# Altium project Squad.PrjPcb (part 1 of 2)
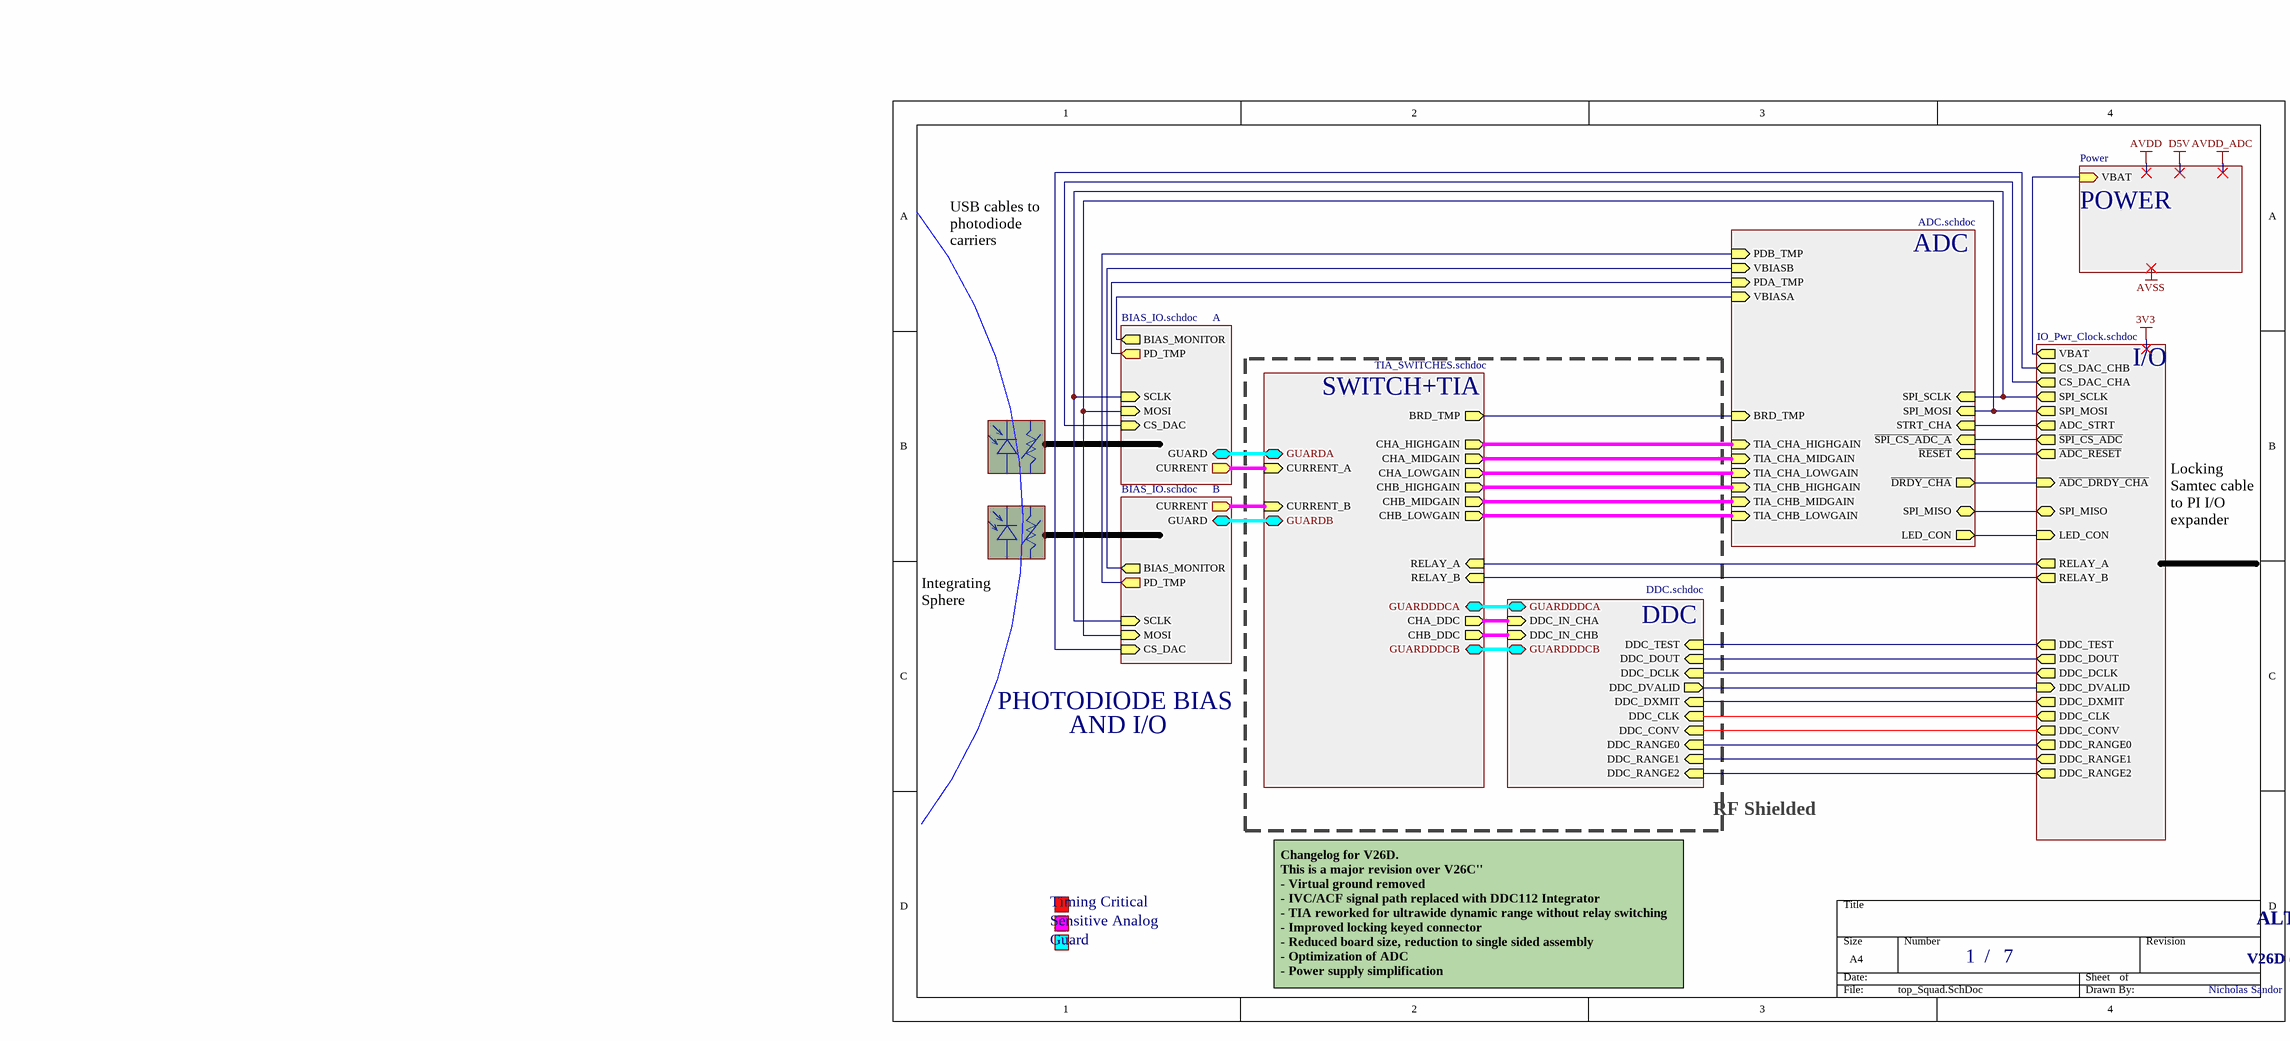
[diagram p0: top_Squad.SchDoc]
DrawnBy: Nicholas Sandor; Revision: V26D (V26.5a)
7 sheets, 171 parts. Net scope: hierarchical (ports join the sheet entries above them; power ports are global).
Board file: ALTAIR_PD_Squad_V26.5a.PcbDoc
Sheets:
  top_Squad.SchDoc
    POWER = Power.SchDoc
    I/O = IO_Pwr_Clock.SchDoc
    ADC = ADC.SchDoc
    SWITCH+TIA = TIA_SWITCHES.SchDoc
    A = BIAS_IO.SchDoc
    B = BIAS_IO.SchDoc
    DDC = DDC.SchDoc

## Sheet top_Squad.SchDoc
size A4; SheetNumber: 1; SheetTotal: 7

### Sub-sheets
A = BIAS_IO.schdoc: CURRENT (out), GUARD (bidir), BIAS_MONITOR (out), PD_TMP (out), SCLK (in), MOSI (in), CS_DAC (in)
ADC = ADC.schdoc: SPI_MISO (bidir), ~{DRDY_CHA} (out), ~{RESET} (in), ~{SPI_CS_ADC_A} (in), STRT_CHA (in), TIA_CHB_LOWGAIN (in), TIA_CHB_MIDGAIN (in), TIA_CHB_HIGHGAIN (in), TIA_CHA_LOWGAIN (in), TIA_CHA_MIDGAIN (in), TIA_CHA_HIGHGAIN (in), BRD_TMP (in), LED_CON (out), VBIASA (in), PDA_TMP (in), SPI_MOSI (in), SPI_SCLK (in), VBIASB (in), PDB_TMP (in)
B = BIAS_IO.schdoc: CURRENT (out), GUARD (bidir), MOSI (in), SCLK (in), CS_DAC (in), BIAS_MONITOR (out), PD_TMP (out)
DDC = DDC.schdoc: DDC_CONV (in), DDC_CLK (in), DDC_IN_CHA (in), DDC_IN_CHB (in), DDC_RANGE2 (in), DDC_RANGE0 (in), DDC_RANGE1 (in), DDC_DXMIT (in), DDC_DVALID (out), DDC_DCLK (in), DDC_DOUT (in), DDC_TEST (in), GUARDDDCA (bidir), GUARDDDCB (bidir)
I/O = IO_Pwr_Clock.schdoc: DDC_RANGE2 (out), DDC_RANGE1 (out), DDC_RANGE0 (out), DDC_CONV (out), DDC_CLK (out), DDC_DXMIT (out), DDC_DVALID (in), DDC_DCLK (out), DDC_DOUT (out), DDC_TEST (out), RELAY_A (out), RELAY_B (out), ~{ADC_DRDY_CHA} (in), ~{SPI_CS_ADC} (out), ~{ADC_RESET} (out), SPI_MISO (bidir), ADC_STRT (out), CS_DAC_CHA (out), VBAT (out), CS_DAC_CHB (out), LED_CON (in), SPI_MOSI (out), SPI_SCLK (out)
POWER = Power: VBAT (in)
SWITCH+TIA = TIA_SWITCHES.schdoc: CHB_HIGHGAIN (out), CHB_MIDGAIN (out), CHB_LOWGAIN (out), CHA_LOWGAIN (out), CHA_MIDGAIN (out), CHA_HIGHGAIN (out), CURRENT_A (in), CURRENT_B (in), CHB_DDC (out), CHA_DDC (out), RELAY_B (in), RELAY_A (in), GUARDDDCA (bidir), GUARDDDCB (bidir), GUARDB (bidir), GUARDA (bidir), BRD_TMP (out)

### Nets
~{DRDY}: sheet I/O/~{ADC_DRDY_CHA}, sheet ADC/~{DRDY_CHA}
~{SPI_CS_ADC}: sheet I/O/~{SPI_CS_ADC}, sheet ADC/~{SPI_CS_ADC_A}
ADC_RESET: sheet I/O/~{ADC_RESET}, sheet ADC/~{RESET}
BRD_TMP_ADCIN: sheet ADC/BRD_TMP, sheet SWITCH+TIA/BRD_TMP
DDC_CLK: sheet I/O/DDC_CLK, sheet DDC/DDC_CLK
DDC_CONV: sheet I/O/DDC_CONV, sheet DDC/DDC_CONV
DDC_DCLK: sheet I/O/DDC_DCLK, sheet DDC/DDC_DCLK
DDC_DOUT: sheet I/O/DDC_DOUT, sheet DDC/DDC_DOUT
DDC_DVALID: sheet I/O/DDC_DVALID, sheet DDC/DDC_DVALID
DDC_DXMIT: sheet I/O/DDC_DXMIT, sheet DDC/DDC_DXMIT
DDC_RANGE0: sheet I/O/DDC_RANGE0, sheet DDC/DDC_RANGE0
DDC_RANGE1: sheet I/O/DDC_RANGE1, sheet DDC/DDC_RANGE1
DDC_RANGE2: sheet I/O/DDC_RANGE2, sheet DDC/DDC_RANGE2
DDC_TEST: sheet I/O/DDC_TEST, sheet DDC/DDC_TEST
GUARD: sheet SWITCH+TIA/GUARDDDCA, sheet SWITCH+TIA/GUARDDDCB, sheet SWITCH+TIA/GUARDB, sheet SWITCH+TIA/GUARDA, sheet A/GUARD, sheet B/GUARD, sheet DDC/GUARDDDCA, sheet DDC/GUARDDDCB
LEDCONTROL_GPIO: sheet I/O/LED_CON, sheet ADC/LED_CON
PD_A: sheet SWITCH+TIA/CURRENT_A, sheet A/CURRENT
PD_A: sheet SWITCH+TIA/CURRENT_B, sheet B/CURRENT  [a separate net that carries the same name]
PD_K: sheet ADC/VBIASA, sheet A/BIAS_MONITOR
PD_K: sheet ADC/VBIASB, sheet B/BIAS_MONITOR  [a separate net that carries the same name]
PDA_TMP_ADCIN: sheet ADC/PDA_TMP, sheet A/PD_TMP
PDB_TMP_ADCIN: sheet ADC/PDB_TMP, sheet B/PD_TMP
RELAY_A: sheet I/O/RELAY_A, sheet SWITCH+TIA/RELAY_A
RELAY_B: sheet I/O/RELAY_B, sheet SWITCH+TIA/RELAY_B
rSPI_MOSI: sheet I/O/SPI_MOSI, sheet ADC/SPI_MOSI, sheet A/MOSI, sheet B/MOSI
rSPI_SCLK: sheet I/O/SPI_SCLK, sheet ADC/SPI_SCLK, sheet A/SCLK, sheet B/SCLK
SPI_CS_DAC_CHA: sheet I/O/CS_DAC_CHA, sheet A/CS_DAC
SPI_CS_DAC_CHB: sheet I/O/CS_DAC_CHB, sheet B/CS_DAC
SPI_MISO: sheet I/O/SPI_MISO, sheet ADC/SPI_MISO
STRT: sheet I/O/ADC_STRT, sheet ADC/STRT_CHA
SYS_VBAT_RB: sheet POWER/VBAT, sheet I/O/VBAT
NetK1_4: sheet SWITCH+TIA/CHB_DDC, sheet DDC/DDC_IN_CHB
NetK1_5: sheet SWITCH+TIA/CHA_DDC, sheet DDC/DDC_IN_CHA
NetR1_2: sheet ADC/TIA_CHA_LOWGAIN, sheet SWITCH+TIA/CHA_LOWGAIN
NetR3_2: sheet ADC/TIA_CHA_MIDGAIN, sheet SWITCH+TIA/CHA_MIDGAIN
NetR8_2: sheet ADC/TIA_CHA_HIGHGAIN, sheet SWITCH+TIA/CHA_HIGHGAIN
NetR14_2: sheet ADC/TIA_CHB_LOWGAIN, sheet SWITCH+TIA/CHB_LOWGAIN
NetR16_2: sheet ADC/TIA_CHB_MIDGAIN, sheet SWITCH+TIA/CHB_MIDGAIN
NetR21_2: sheet ADC/TIA_CHB_HIGHGAIN, sheet SWITCH+TIA/CHB_HIGHGAIN

### Notes on the sheet
- USB cables to photodiode carriers
- Locking Samtec cable to PI I/O expander
- Integrating Sphere
- PHOTODIODE BIAS
- AND I/O
- RF Shielded
- Timing Critical
- Sensitive Analog
- Guard
- Changelog for V26D.
  This is a major revision over V26C''
  - Virtual ground removed
  - IVC/ACF signal path replaced with DDC112 Integrator
  - TIA reworked for ultrawide dynamic range without relay switching
  - Improved locking keyed connector
  - Reduced board size, reduction to single sided assembly
  - Optimization of ADC
  - Power supply simplification
- /
- ALTAIR PhotoDiode ReadOut (PDRO) - Squad
- Labels drawn without touching a wire or pin: AVSS

## Sheet Power.SchDoc
size A4; SheetNumber: 3; SheetTotal: 7
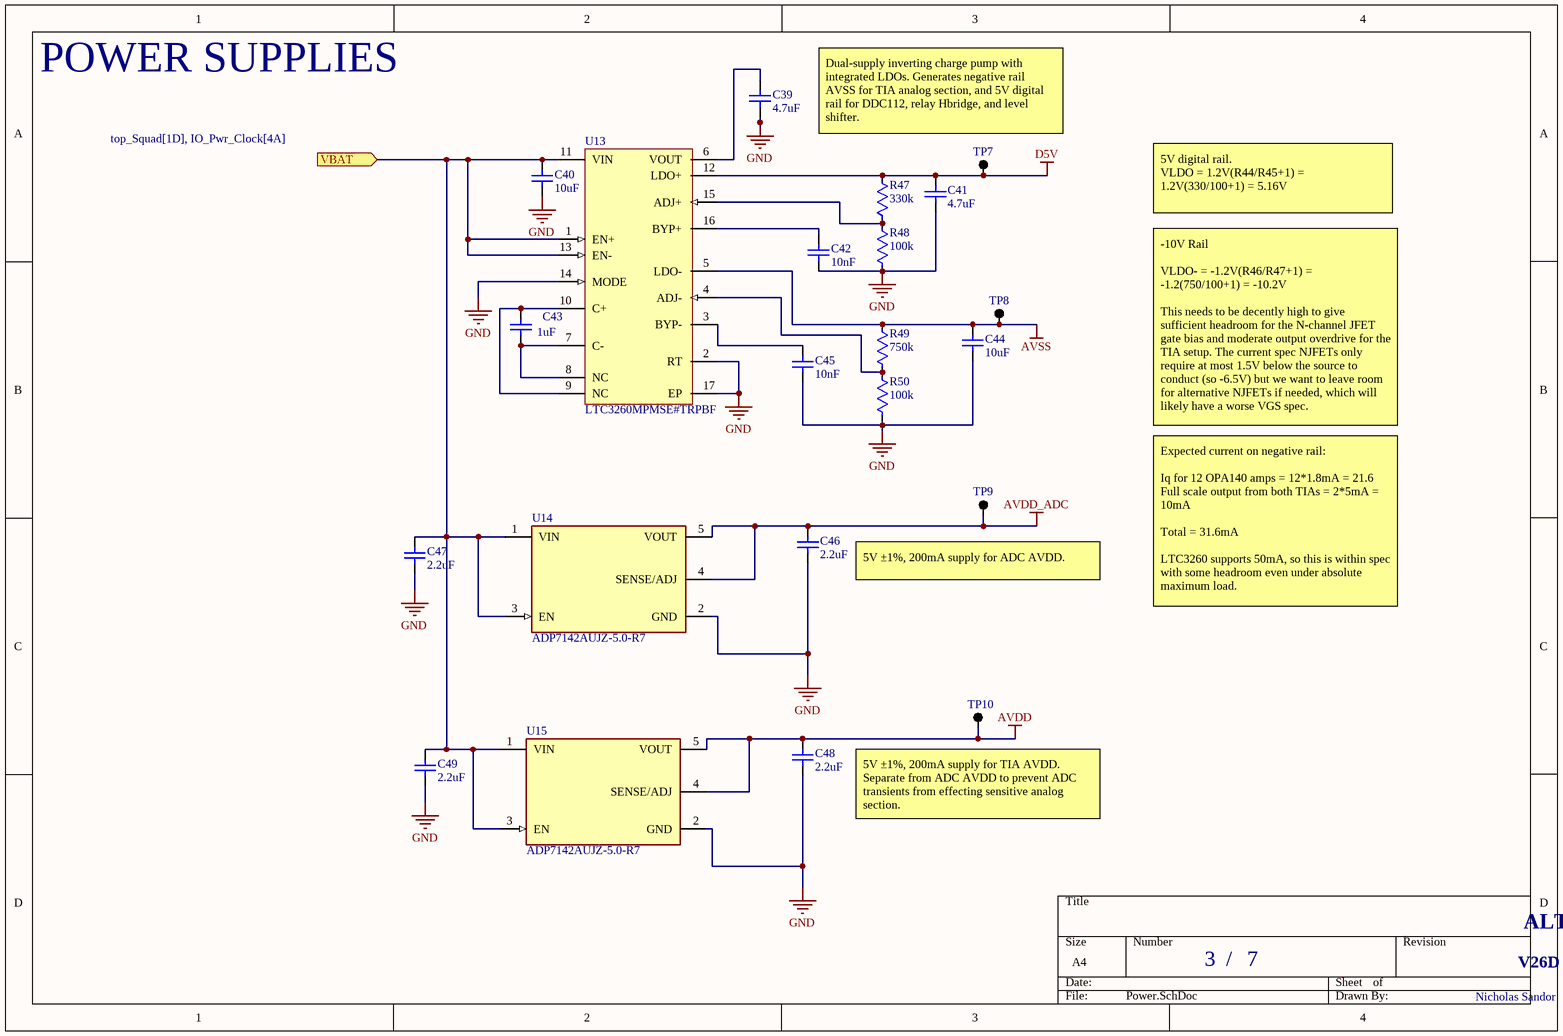
[diagram p1: Power.SchDoc]

### Parts
C39  4.7uF  [CAP 0805 IPC MID DENSITY]
C40  10uF  [CAP 0805 IPC MID DENSITY]
C41  4.7uF  [CAP 0805 IPC MID DENSITY]
C42  10nF  [CAP 0603 IPC MID DENSITY MURATA]
C43  1uF  [CAP 0805 IPC MID DENSITY]
C44  10uF  [CAP 0805 IPC MID DENSITY]
C45  10nF  [CAP 0603 IPC MID DENSITY MURATA]
C46  2.2uF  [CAP 1206 UNKNOWN]
C47  2.2uF  [CAP 1206 UNKNOWN]
C48  2.2uF  [CAP 1206 UNKNOWN]
C49  2.2uF  [CAP 1206 UNKNOWN]
R47  330k  [RES 0603 IPC MID DENSITY]
R48  100k  [RES 0603 IPC MID DENSITY]
R49  750k  [RES 0603 IPC MID DENSITY]
R50  100k  [RES 0603 IPC MID DENSITY]
TP7  Testpoint  [TESTPOINT THT]  (value not drawn)  (no BOM)
TP8  Testpoint  [TESTPOINT THT]  (value not drawn)  (no BOM)
TP9  Testpoint  [TESTPOINT THT]  (value not drawn)  (no BOM)
TP10  Testpoint  [TESTPOINT THT]  (value not drawn)  (no BOM)
U13  LTC3260MPMSE#TRPBF  [LT-MSE-16-EDP_L]
U14  ADP7142AUJZ-5.0-R7  [SOT23-5 HIGH DENSITY AD]
U15  ADP7142AUJZ-5.0-R7  [SOT23-5 HIGH DENSITY AD]

### Ports
VBAT (in, see top_Squad[1D], IO_Pwr_Clock[4A])

### Nets
AVDD: C48.1 TP10.1 U15.4(SENSE/ADJ) U15.5(VOUT)
AVDD_ADC: C46.1 TP9.1 U14.4(SENSE/ADJ) U14.5(VOUT)
AVSS: C44.2 R49.2 TP8.1 U13.5(LDO-)
D5V: C41.2 R47.2 TP7.1 U13.12(LDO+)
GND: C39.1 C40.1 C41.1 C42.1 C44.1 C45.1 C46.2 C47.2 C48.2 C49.2 R48.1 R50.1 U13.2(RT) U13.14(MODE) U13.17(EP) U14.2(GND) U15.2(GND)  [project net SYS_GND]
SYS_VBAT_RB: C40.2 C47.1 C49.1 U13.1(EN+) U13.11(VIN) U13.13(EN-) U14.1(VIN) U14.3(EN) U15.1(VIN) U15.3(EN) ; port VBAT
NetC39_2: C39.2 U13.6(VOUT)
NetC42_2: C42.2 U13.16(BYP+)
NetC43_1: C43.1 U13.7(C-) U13.8(NC)
NetC43_2: C43.2 U13.9(NC) U13.10(C+)
NetC45_2: C45.2 U13.3(BYP-)
NetR47_1: R47.1 R48.2 U13.15(ADJ+)
NetR49_1: R49.1 R50.2 U13.4(ADJ-)

### Notes on the sheet
- POWER SUPPLIES
- Dual-supply inverting charge pump with integrated LDOs. Generates negative rail AVSS for TIA analog section, and 5V digital rail for DDC112, relay Hbridge, and level shifter.
- 5V digital rail.
  VLDO = 1.2V(R44/R45+1) = 1.2V(330/100+1) = 5.16V
- -10V Rail
  VLDO- = -1.2V(R46/R47+1) = -1.2(750/100+1) = -10.2V
  This needs to be decently high to give sufficient headroom for the N-channel JFET gate bias and moderate output overdrive for the TIA setup. The current spec NJFETs only require at most 1.5V below the source to conduct (so -6.5V) but we want to leave room for alternative NJFETs if needed, which will likely have a worse VGS spec.
- 5V ±1%, 200mA supply for ADC AVDD.
- Expected current on negative rail:
  Iq for 12 OPA140 amps = 12*1.8mA = 21.6
  Full scale output from both TIAs = 2*5mA = 10mA
  Total = 31.6mA
  LTC3260 supports 50mA, so this is within spec with some headroom even under absolute maximum load.
- (near TP10) 5V ±1%, 200mA supply for TIA AVDD. Separate from ADC AVDD to prevent ADC transients from effecting sensitive analog section.
- /
- ALTAIR PhotoDiode ReadOut (PDRO) - Squad

### Library data of the parts
C39-C45 = CAP: Murata GRM21BR61E106KA73L - Cap Ceramic 10uF 10% 25V X5R 0805; MF: Murata; MP: GRM21BR61E106KA73L
C46-C49 = CAP: CL31B225KBHNNNE CAP CER 2.2UF 50V X7R 1206; MF: Samsung Electro-Mechanics; MP: CL31B225KBHNNNE
R47 R49 = RES: Panasonic ERJ-3EKF2001V Res Thick Film 0603 2K Ohm 1% 1/10W ±100ppm/°C; MF: Panasonic Electronic Components; MP: ERJ-3EKF2001V
R48 R50 = RES: -55℃~+155℃ 100kΩ 100mW 75V Thick Film Resistor ±1% ±100ppm/℃ 0603 Chip Resistor - Surface Mount ROHS; MF: UNI-ROYAL(Uniroyal Elec); MP: 0603WAF1003T5E
U13 = CMP-0475-00262-1: Low Noise Dual Supply Inverting Charge Pump, 4.5 to 32 V Vin, Adjustable Vout, 16-pin SOP (MSE-16-EDP), -50 to 150 degC, Pb-Free, Tape and Reel; Manufacturer: Linear Technology; Voutput: Adj; Isupply(mA): 0.1; Vin Max(V): 32; Frequency(kHz): 500; Max Iout(mA): 100; Ishutdown(uA): 2; Vin Min(V): 4.5; RoHS: TRUE; ComponentLink1URL: http://www.linear.com/; Packing: Tape and Reel; ComponentLink3Description: Package Specification; ComponentLink3URL: http://cds.linear.com/docs/en/packaging/05081667_F_MSE16.pdf; Mounting Technology: Surface Mount; PackageReference: MSE-16; PackageDescription: 16-Pin Plastic MSOP, Exposed Die Pad, Body 4.039 x 3 mm, Pitch 0.5 mm; ComponentLink1Description: Manufacturer URL; ComponentLink2URL: http://cds.linear.com/docs/en/datasheet/3260fa.pdf; PartNumber: LTC3260MPMSE#TRPBF; PackageVersion: Rev. F, 05/2013; ComponentLink2Description: Datasheet; DatasheetVersion: Rev. A
U14 U15 = ADP7142AUJZ-R7: 1.2-40V 200mA Low Noise CMOS LDO Adjustable Linear Regulator TSOT23; Nominal Supply Current: 50-180uA; Output Type: AdjustableProgrammable; Max Supply Voltage: 40V; Number Of Outputs: 1; Dropout Voltage: 200mV; Output Voltage: 1.2-5V; Min Supply Voltage: 2.7V; Max Junction Temp: +150°C; MF: Analog Devices; Accuracy Percentage: 0.8%; Ambient Temperature Range Low: -40°C; ComponentLink2Description: Datasheet; Digikey Description: IC REG LIN POS ADJ 200MA TSOT23; Device Class L1: Integrated Circuits (ICs); Mouser Description: LDO Regulator Pos 1.5V to 5V 0.2A 5-Pin TSOT-23 T/R; Height: 1mm; Temperature Range Low: -40°C; Output Current: 200mA; Device Class L3: Voltage Regulators - Linear; Octopart: https://octopart.com/adp7142aujz-r7-analog+devices-38928114; Category: IC; MP: ADP7142AUJZ-5.0-R7; ComponentLink2URL: https://www.analog.com/media/en/technical-documentation/data-sheets/ADP7142.pdf; Device Class L2: Power Management ICs; Package: UJ-5; Automotive: No; Lead Free: Yes; Ambient Temperature Range High: +125°C; Temperature: -40°C to +125°C; Temperature Range High: +125°C; RoHS: TRUE; Manufacturer: Analog Devices; Manufacturer Part Number: ADP7142AUJZ-R7

## Sheet IO_Pwr_Clock.SchDoc
size A4; SheetNumber: 2; SheetTotal: 7
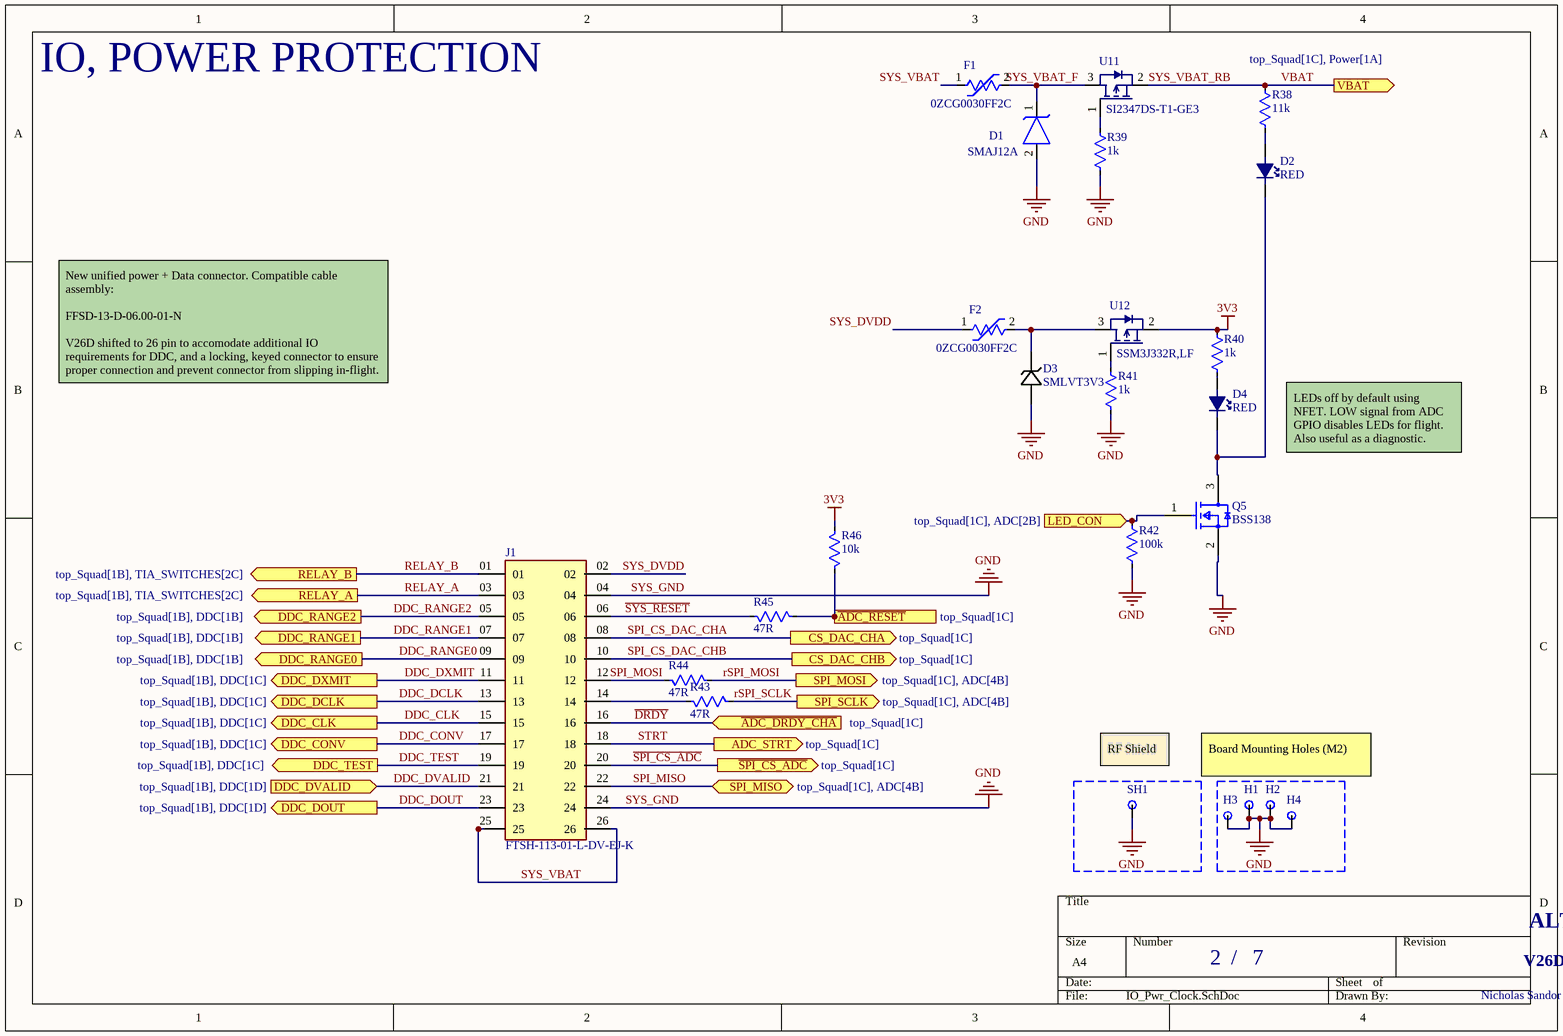
[diagram p2: IO_Pwr_Clock.SchDoc]

### Parts
D1  SMAJ12A  [DO-214AC SMA VISHAY]
D2  RED  [LED 0603 MID DENSITY]
D3  SMLVT3V3  [SMB_STM]
D4  RED  [LED 0603 MID DENSITY]
F1  0ZCG0030FF2C  [POLYFUSE 1812 NON-IPC BELFUSE]
F2  0ZCG0030FF2C  [POLYFUSE 1812 NON-IPC BELFUSE]
H1  Mount-hole  [M3 PTH FOR 4.5MM HEX]  (value not drawn)  (no BOM)
H2  Mount-hole  [M3 PTH FOR 4.5MM HEX]  (value not drawn)  (no BOM)
H3  Mount-hole  [M3 PTH FOR 4.5MM HEX]  (value not drawn)  (no BOM)
H4  Mount-hole  [M3 PTH FOR 4.5MM HEX]  (value not drawn)  (no BOM)
J1  FTSH-113-01-L-DV-EJ-K  [SAMTEC_FTSH-113-01-L-DV-EJ-K]
Q5  BSS138  [FP-318-08-IPC_B]
R38  11k  [RES 0603 IPC MID DENSITY]
R39  1k  [RES 0603 IPC MID DENSITY]
R40  1k  [RES 0603 IPC MID DENSITY]
R41  1k  [RES 0603 IPC MID DENSITY]
R42  100k  [RES 0603 IPC MID DENSITY]
R43  47R  [RES 0402 NON-IPC SEI]
R44  47R  [RES 0402 NON-IPC SEI]
R45  47R  [RES 0402 NON-IPC SEI]
R46  10k  [RES 0603 IPC MID DENSITY]
SH1  Mount-hole  [MS511-10]  (value not drawn)  (no BOM)
U11  SI2347DS-T1-GE3  [SOT95P245X110-3N]
U12  SSM3J332R,LF  [SOT95P245X110-3N]

### Ports
ADC_STRT (out, see top_Squad[1C]), CS_DAC_CHA (out, see top_Squad[1C]), CS_DAC_CHB (out, see top_Squad[1C]), DDC_CLK (out, see top_Squad[1B], DDC[1C]), DDC_CONV (out, see top_Squad[1B], DDC[1C]), DDC_DCLK (out, see top_Squad[1B], DDC[1C]), DDC_DOUT (out, see top_Squad[1B], DDC[1D]), DDC_DVALID (in, see top_Squad[1B], DDC[1D]), DDC_DXMIT (out, see top_Squad[1B], DDC[1C]), DDC_RANGE0 (out, see top_Squad[1B], DDC[1B]), DDC_RANGE1 (out, see top_Squad[1B], DDC[1B]), DDC_RANGE2 (out, see top_Squad[1B], DDC[1B]), DDC_TEST (out, see top_Squad[1B], DDC[1C]), LED_CON (in, see top_Squad[1C], ADC[2B]), RELAY_A (out, see top_Squad[1B], TIA_SWITCHES[2C]), RELAY_B (out, see top_Squad[1B], TIA_SWITCHES[2C]), SPI_MISO (bidir, see top_Squad[1C], ADC[4B]), SPI_MOSI (out, see top_Squad[1C], ADC[4B]), SPI_SCLK (out, see top_Squad[1C], ADC[4B]), VBAT (out, see top_Squad[1C], Power[1A]), ~{ADC_DRDY_CHA} (in, see top_Squad[1C]), ~{ADC_RESET} (out, see top_Squad[1C]), ~{SPI_CS_ADC} (out, see top_Squad[1C])

### Nets
3V3: R40.2 R46.1 U12.2(Source)
SYS_GND: D1.2(Anode) D3.2 H1.1 H2.1 H3.1 H4.1 J1.04 J1.24 Q5.2(S) R39.1 R41.1 R42.1 SH1.1  [also labelled GND]
~{DRDY}: J1.16 ; port ~{ADC_DRDY_CHA}
~{SPI_CS_ADC}: J1.20 ; port ~{SPI_CS_ADC}
~{SYS_RESET}: J1.06 R45.1
ADC_RESET: R45.2 R46.2 ; port ~{ADC_RESET}
DDC_CLK: J1.15 ; port DDC_CLK
DDC_CONV: J1.17 ; port DDC_CONV
DDC_DCLK: J1.13 ; port DDC_DCLK
DDC_DOUT: J1.23 ; port DDC_DOUT
DDC_DVALID: J1.21 ; port DDC_DVALID
DDC_DXMIT: J1.11 ; port DDC_DXMIT
DDC_RANGE0: J1.09 ; port DDC_RANGE0
DDC_RANGE1: J1.07 ; port DDC_RANGE1
DDC_RANGE2: J1.05 ; port DDC_RANGE2
DDC_TEST: J1.19 ; port DDC_TEST
LEDCONTROL_GPIO: Q5.1(G) R42.2 ; port LED_CON
RELAY_A: J1.03 ; port RELAY_A
RELAY_B: J1.01 ; port RELAY_B
rSPI_MOSI: R44.2 ; port SPI_MOSI
rSPI_SCLK: R43.2 ; port SPI_SCLK
SPI_CS_DAC_CHA: J1.08 ; port CS_DAC_CHA
SPI_CS_DAC_CHB: J1.10 ; port CS_DAC_CHB
SPI_MISO: J1.22 ; port SPI_MISO
SPI_MOSI: J1.12 R44.1
STRT: J1.18 ; port ADC_STRT
SYS_DVDD: F2.1 J1.02
SYS_VBAT: F1.1 J1.25 J1.26
SYS_VBAT_F: D1.1(Cathode) F1.2 U11.3(Drain)
SYS_VBAT_RB: R38.2 U11.2(Source) ; port VBAT  [also labelled VBAT]
NetD2_1: D2.1 D4.1 Q5.3(D)
NetD2_2: D2.2 R38.1
NetD3_1: D3.1 F2.2 U12.3(Drain)
NetD4_2: D4.2 R40.1
NetJ1_14: J1.14 R43.1
NetR39_2: R39.2 U11.1(Gate)
NetR41_2: R41.2 U12.1(Gate)

### Notes on the sheet
- IO, POWER PROTECTION
- New unified power + Data connector. Compatible cable assembly:
  FFSD-13-D-06.00-01-N
  V26D shifted to 26 pin to accomodate additional IO requirements for DDC, and a locking, keyed connector to ensure proper connection and prevent connector from slipping in-flight.
- LEDs off by default using NFET. LOW signal from ADC GPIO disables LEDs for flight. Also useful as a diagnostic.
- (near SH1) RF Shield
- Board Mounting Holes (M2)
- /
- ALTAIR PhotoDiode ReadOut (PDRO) - Squad

### Library data of the parts
D1 = Zener: Vishay SMAJ12A-M3/61 - TVS Diode 12V Standoff 13.3V Breakdown DO-214AC; MF: Vishay General Semiconductor; MP: SMAJ12A-M3/61
D2 D4 = LED-blue: LED RED CLEAR 0603 SMD; Color: Blue; Luminous Intensity: 145mcd; Forward Current: 30mA; Forward Voltage: 3.2V; Wavelength: 470nm; Viewing Angle: 140°; Lens Style: Clear,Rectangular; Test Current: 20mA; MF: Wurth Electronics; MP: 150060RS75000; RoHS: Yes; Category: LEDs; Stock 1: 66561; Mount: Surface Mount; Case/Package: 0603; Case Code (Metric): 1608; Case Code (Imperial): 0603; Min Operating Temperature: -40°C; Max Operating Temperature: 85°C; Package Quantity: 4000; Packaging: Cut Tape; Dominant Wavelength: 470nm; Length: 1.6mm; Height: 0.7mm; Width: 0.8mm; REACH SVHC: Unknown; ComponentLink1URL: https://datasheet.ciiva.com/29563/150060bs75000-29563034.pdf?src-supplier=Digi-Key; ComponentLink1Description: https://datasheet.ciiva.com/29563/150060bs75000-29563034.pdf?src-supplier=Digi-Key; ComponentLink2URL: https://datasheet.ciiva.com/29279/759426-da-01-en-chipled-0603-w-kl-blau-150060bs75000-29279193.pdf?src-supplier=Conrad; ComponentLink2Description: https://datasheet.ciiva.com/29279/759426-da-01-en-chipled-0603-w-kl-blau-150060bs75000-29279193.pdf?src-supplier=Conrad; ComponentLink3URL: https://datasheet.ciiva.com/29563/150060bs75000-29563035.pdf?src-supplier=Digi-Key; ComponentLink3Description: https://datasheet.ciiva.com/29563/150060bs75000-29563035.pdf?src-supplier=Digi-Key; ComponentLink4URL: https://datasheet.ciiva.com/29563/150060bs75000-29563036.pdf?src-supplier=Digi-Key; ComponentLink4Description: https://datasheet.ciiva.com/29563/150060bs75000-29563036.pdf?src-supplier=Digi-Key; ComponentLink5URL: https://datasheet.ciiva.com/22656/1911343-22656939.pdf?src-supplier=Element14; ComponentLink5Description: https://datasheet.ciiva.com/22656/1911343-22656939.pdf?src-supplier=Element14; ComponentLink6URL: https://datasheet.ciiva.com/48430/150060bs75000-eng-tds-48430039.pdf?src-supplier=Distrelec; ComponentLink6Description: https://datasheet.ciiva.com/48430/150060bs75000-eng-tds-48430039.pdf?src-supplier=Distrelec; Supplier 1: Digi-Key; Supplier Part Number 1: 732-4966-1-ND
D3 = SMLVT3V3: 600 W, 3.3 V TVS in SMB; Manufacturer_Name: STMicroelectronics; Copyright: Copyright (C) 2025 Ultra Librarian. All rights reserved.; Manufacturer_Part_Number: SMLVT3V3; Refdes: Refdes
F1 F2 = Polyfuse: Bel Fuse 0ZCG0030FF2C - Polymeric PTC Resettable Fuse 30V 300mA hold 600mA trip SMD 1812; MF: Bel Fuse Inc.; MP: 0ZCG0030FF2C
H1-H4 SH1 = Mount-hole: (Plated) Mounting hole
Q5 = CMP-07173-000101-1: MOSFET N-CH 50V 220MA SOT-23; Turn-Off Delay Time: 20ns; Element Configuration: Single; Rds On Max: 3.5R; Gate to Source Voltage (Vgs): 20V; Threshold Voltage: 1.3V; Number of Elements: 1; Power Dissipation: 360mW; Rise Time: 9ns; Turn-On Delay Time: 2.5ns; Input Capacitance: 27pF; On-State Resistance: 6R; Lead Free: Lead Free; Length: 2.92mm; Width: 1.3mm; Drain to Source Breakdown Voltage: 50V; Min Operating Temperature: -55°C; REACH SVHC: No SVHC; Packaging: Tape and Reel; Radiation Hardening: No; Height: 0.93mm; Drain to Source Voltage (Vdss): 50V; Current Rating: 220mA; Voltage Rating (DC): 50V; Weight: 0.03g; Continuous Drain Current (ID): 220mA; Number of Pins: 3; Nominal Vgs: 1.3V; Max Power Dissipation: 360mW; Fall Time: 9ns; Drain to Source Resistance: 3.5R; Contact Plating: Tin; Case/Package: SOT-23; Package Quantity: 1; Dual Supply Voltage: 50V; Mount: Surface Mount; Termination: SMD/SMT; Max Operating Temperature: 150°C
R38 = RES: MF: Panasonic Electronic Components; MP: ERJ-U03F1001V
R39-R41 = RES: Panasonic ERJ-U03F1001V - Res SMD 1 kOhm 1% 1/10W 0603; MF: Panasonic Electronic Components; MP: ERJ-U03F1001V
R42 = RES: as R48 on sheet Power
R43-R45 = RES: Stackpole RMCF0402JT47R0 - Res 47Ohm 5% 0.063W 0402 Thick Film AEC-Q200 compliant; MF: Stackpole Electronics Inc.; MP: RMCF0402JT47R0
R46 = RES: Vishay CRCW060310K0FKEA SMD 0603 10k, CRCW e3 Series, 75V, thick film, 100mW; MF: Vishay Dale; MP: CRCW060310K0FKEA
U11 = PMOS: MOSFET P-CH 30V 5A SOT23-3; MF: Vishay Siliconix; Supplier 1: Avnet; Supplier Part Number 1: SI2347DS-T1-GE3; MP: SI2347DS-T1-GE3
U12 = PMOS_LV: P-Channel 30 V 6A (Ta) 1W (Ta) Surface Mount SOT-23F; MF: Toshiba; Supplier 1: Avnet; Supplier Part Number 1: SI2347DS-T1-GE3; MP: SSM3J332R,LF
J1 = FTSH-113-01-L-DV-EJ-K: Price: None; Value: *; Package: None; MP: FTSH-113-01-L-DV-EJ-K; Availability: Unavailable

## Sheet ADC.SchDoc
size A4; SheetNumber: 6; SheetTotal: 7
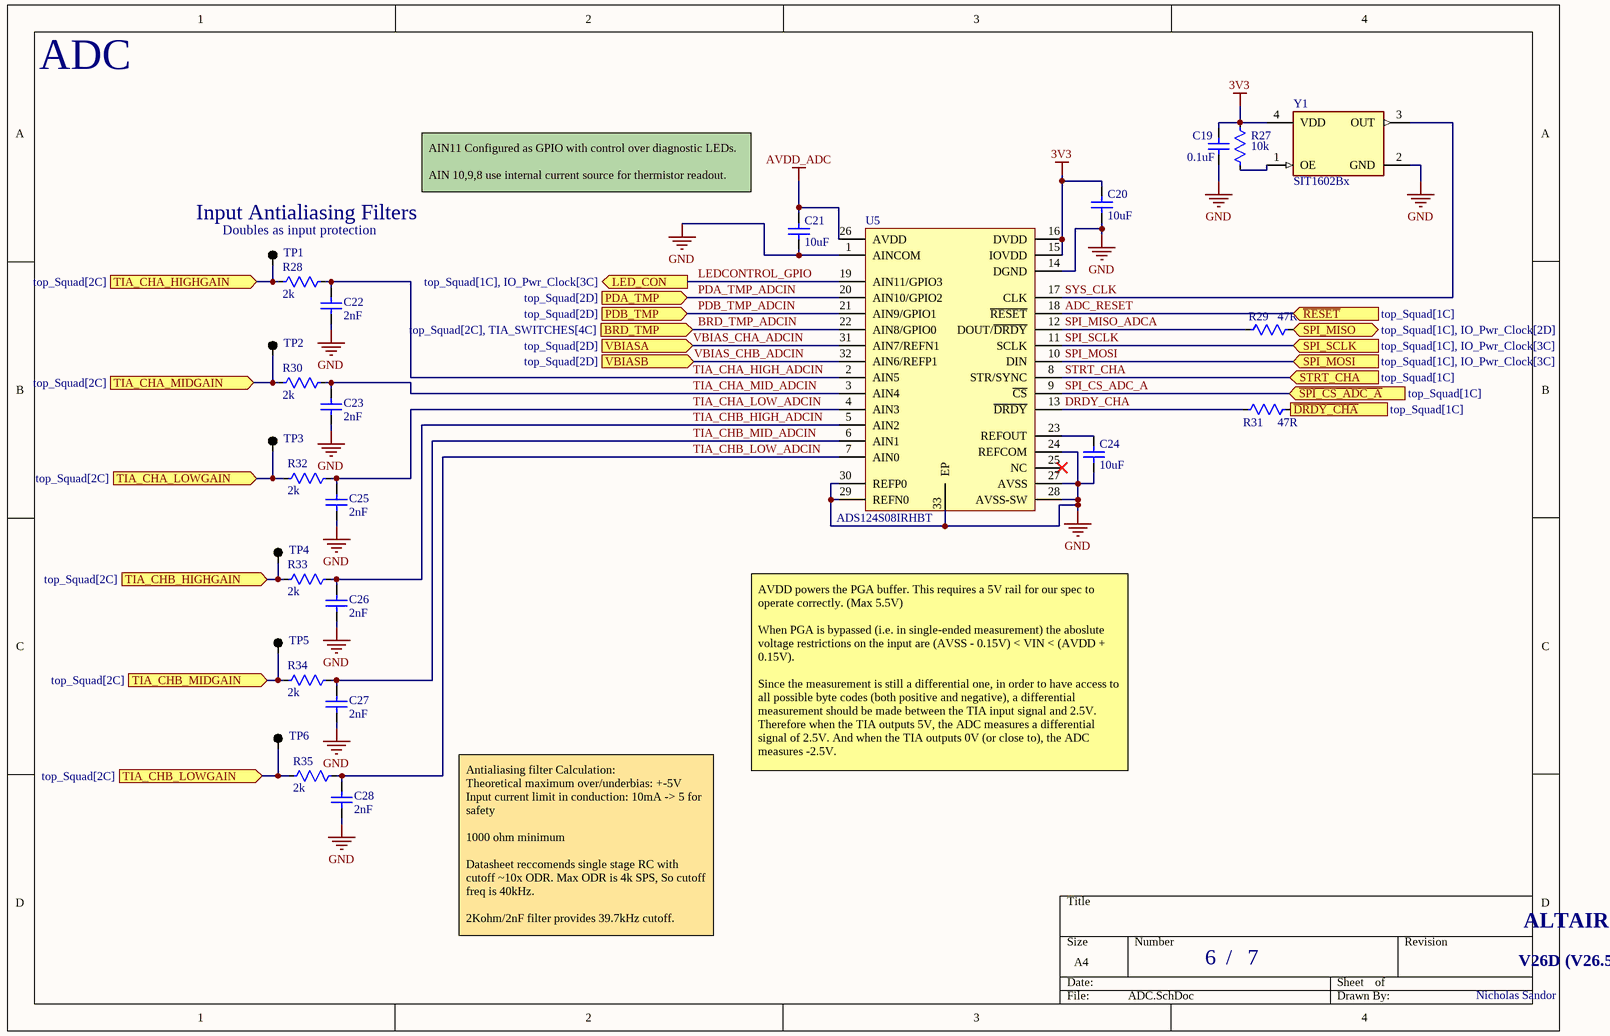
[diagram p3: ADC.SchDoc]

### Parts
C19  0.1uF  [CAP 0603 IPC MID DENSITY]
C20  10uF  [CAP 0805 IPC MID DENSITY]
C21  10uF  [CAP 0805 IPC MID DENSITY]
C22  2nF  [RES 0402 IPC MID DENSITY]
C23  2nF  [RES 0402 IPC MID DENSITY]
C24  10uF  [CAP 0805 IPC MID DENSITY]
C25  2nF  [RES 0402 IPC MID DENSITY]
C26  2nF  [RES 0402 IPC MID DENSITY]
C27  2nF  [RES 0402 IPC MID DENSITY]
C28  2nF  [RES 0402 IPC MID DENSITY]
R27  10k  [RES 0603 IPC MID DENSITY]
R28  2k  [RES 0402 IPC MID DENSITY]
R29  47R  [RES 0402 NON-IPC SEI]
R30  2k  [RES 0402 IPC MID DENSITY]
R31  47R  [RES 0402 NON-IPC SEI]
R32  2k  [RES 0402 IPC MID DENSITY]
R33  2k  [RES 0402 IPC MID DENSITY]
R34  2k  [RES 0402 IPC MID DENSITY]
R35  2k  [RES 0402 IPC MID DENSITY]
TP1  Testpoint  [TESTPOINT THT]  (value not drawn)  (no BOM)
TP2  Testpoint  [TESTPOINT THT]  (value not drawn)  (no BOM)
TP3  Testpoint  [TESTPOINT THT]  (value not drawn)  (no BOM)
TP4  Testpoint  [TESTPOINT THT]  (value not drawn)  (no BOM)
TP5  Testpoint  [TESTPOINT THT]  (value not drawn)  (no BOM)
TP6  Testpoint  [TESTPOINT THT]  (value not drawn)  (no BOM)
U5  ADS124S08IRHBT  [QFN50P500X500X100_HS-33L]
Y1  SIT1602Bx  [4PQFN NON-IPC SITIME]

### Ports
BRD_TMP (in, see top_Squad[2C], TIA_SWITCHES[4C]), LED_CON (out, see top_Squad[1C], IO_Pwr_Clock[3C]), PDA_TMP (in, see top_Squad[2D]), PDB_TMP (in, see top_Squad[2D]), SPI_MISO (bidir, see top_Squad[1C], IO_Pwr_Clock[2D]), SPI_MOSI (in, see top_Squad[1C], IO_Pwr_Clock[3C]), SPI_SCLK (in, see top_Squad[1C], IO_Pwr_Clock[3C]), STRT_CHA (in, see top_Squad[1C]), TIA_CHA_HIGHGAIN (in, see top_Squad[2C]), TIA_CHA_LOWGAIN (in, see top_Squad[2C]), TIA_CHA_MIDGAIN (in, see top_Squad[2C]), TIA_CHB_HIGHGAIN (in, see top_Squad[2C]), TIA_CHB_LOWGAIN (in, see top_Squad[2C]), TIA_CHB_MIDGAIN (in, see top_Squad[2C]), VBIASA (in, see top_Squad[2D]), VBIASB (in, see top_Squad[2D]), ~{DRDY_CHA} (out, see top_Squad[1C]), ~{RESET} (in, see top_Squad[1C]), ~{SPI_CS_ADC_A} (in, see top_Squad[1C])

### Nets
3V3: C19.2 C20.2 R27.2 U5.15(IOVDD) U5.16(DVDD) Y1.4(VDD)
AVDD_ADC: C21.2 U5.26(AVDD)
GND: C19.1 C20.1 C21.1 C22.1 C23.1 C24.1 C25.1 C26.1 C27.1 C28.1 U5.1(AINCOM) U5.14(DGND) U5.24(REFCOM) U5.27(AVSS) U5.28(AVSS-SW) U5.29(REFN0) U5.30(REFP0) U5.33(EP) Y1.2(GND)  [project net SYS_GND]
~{DRDY}: R31.2 ; port ~{DRDY_CHA}
ADC_RESET: U5.18(~{RESET}) ; port ~{RESET}
BRD_TMP_ADCIN: U5.22(AIN8/GPIO0) ; port BRD_TMP
DRDY_CHA: R31.1 U5.13(~{DRDY})
LEDCONTROL_GPIO: U5.19(AIN11/GPIO3) ; port LED_CON
PDA_TMP_ADCIN: U5.20(AIN10/GPIO2) ; port PDA_TMP
PDB_TMP_ADCIN: U5.21(AIN9/GPIO1) ; port PDB_TMP
SPI_CS_ADC_A: U5.9(~{CS}) ; port ~{SPI_CS_ADC_A}  [project net ~{SPI_CS_ADC}]
SPI_MISO: R29.2 ; port SPI_MISO
SPI_MISO_ADCA: R29.1 U5.12(DOUT/~{DRDY})
SPI_MOSI: U5.10(DIN) ; port SPI_MOSI  [project net rSPI_MOSI]
SPI_SCLK: U5.11(SCLK) ; port SPI_SCLK  [project net rSPI_SCLK]
STRT_CHA: U5.8(STR/SYNC) ; port STRT_CHA  [project net STRT]
SYS_CLK: U5.17(CLK) Y1.3(OUT)
TIA_CHA_HIGH_ADCIN: C22.2 R28.2 U5.2(AIN5)
TIA_CHA_LOW_ADCIN: C25.2 R32.2 U5.4(AIN3)
TIA_CHA_MID_ADCIN: C23.2 R30.2 U5.3(AIN4)
TIA_CHB_HIGH_ADCIN: C26.2 R33.2 U5.5(AIN2)
TIA_CHB_LOW_ADCIN: C28.2 R35.2 U5.7(AIN0)
TIA_CHB_MID_ADCIN: C27.2 R34.2 U5.6(AIN1)
VBIAS_CHA_ADCIN: U5.31(AIN7/REFN1) ; port VBIASA  [project net PD_K]
VBIAS_CHB_ADCIN: U5.32(AIN6/REFP1) ; port VBIASB  [project net PD_K]
NetC24_2: C24.2 U5.23(REFOUT)
NetR1_2: R32.1 TP3.1 ; port TIA_CHA_LOWGAIN
NetR3_2: R30.1 TP2.1 ; port TIA_CHA_MIDGAIN
NetR8_2: R28.1 TP1.1 ; port TIA_CHA_HIGHGAIN
NetR14_2: R35.1 TP6.1 ; port TIA_CHB_LOWGAIN
NetR16_2: R34.1 TP5.1 ; port TIA_CHB_MIDGAIN
NetR21_2: R33.1 TP4.1 ; port TIA_CHB_HIGHGAIN
NetR27_1: R27.1 Y1.1(OE)

Not connected (* = marked no-connect by the designer): U5 25(NC)*

### Notes on the sheet
- ADC
- (near TP1) Input Antialiasing Filters
- (near TP1) Doubles as input protection
- AIN11 Configured as GPIO with control over diagnostic LEDs.
  AIN 10,9,8 use internal current source for thermistor readout.
- AVDD powers the PGA buffer. This requires a 5V rail for our spec to operate correctly. (Max 5.5V)
  When PGA is bypassed (i.e. in single-ended measurement) the aboslute voltage restrictions on the input are (AVSS - 0.15V) < VIN < (AVDD + 0.15V).
  Since the measurement is still a differential one, in order to have access to all possible byte codes (both positive and negative), a differential measurement should be made between the TIA input signal and 2.5V. Therefore when the TIA outputs 5V, the ADC measures a differential signal of 2.5V. And when the TIA outputs 0V (or close to), the ADC measures -2.5V.
- Antialiasing filter Calculation:
  Theoretical maximum over/underbias: +-5V
  Input current limit in conduction: 10mA -> 5 for safety
  1000 ohm minimum
  Datasheet reccomends single stage RC with cutoff ~10x ODR. Max ODR is 4k SPS, So cutoff freq is 40kHz.
  2Kohm/2nF filter provides 39.7kHz cutoff.
- /
- ALTAIR PhotoDiode ReadOut (PDRO) - Squad

### Library data of the parts
C19 = CAP: Kemet C0603C104K5RACAUTO - Cap Ceramic 0.1uF 50V X7R 10% 0603 125C Paper T/R; MF: Kemet; MP: C0603C104K5RACAUTO
C20 C21 C24 = CAP: Murata GRM21BR61H106KE43L; MF: Murata; MP: Murata GRM21BR61H106KE43L
C22 C23 C25-C28 = CAP: Murata GCM1885C1H202FA16J 50V 2nF C0G ±1% 0603; MF: Murata; MP: GCM1885C1H202FA16J
R27 = RES: as R46 on sheet IO_Pwr_Clock; MP: CRCW060310K0FKEA
R28 R30 R32-R35 = RES: as R47 on sheet Power; MP: ERJ-3EKF2001V
R29 R31 = RES: as R43 on sheet IO_Pwr_Clock; MP: RMCF0402JT47R0
U5 = ADS124S08IRHBT: 24BIT ADC Delta-Sigma 4k samples/s PGA V-reference; Manufacturer 1: Texas Instruments; Manufacturer Part Number 1: ADS124S08IPBSR; Interface: SPI; Number of Inputs: 12; Number of Bits: 24; Sampling Rate: 4000S/s; Number of A/D Converters: 1; RoHS: No; Category: Analog to Digital Converters (ADCs); Stock 1: 2523; Mount: Surface Mount; Case/Package: LQFP; Number of Pins: 32; Min Operating Temperature: -50°C; Max Operating Temperature: 125°C; Packaging: Tape and Reel; ComponentLink1URL: http://www.ti.com/general/docs/lit/getliterature.tsp?genericPartNumber=ADS124S08&fileType=pdf&src-supplier=Farnell; ComponentLink1Description: http://www.ti.com/general/docs/lit/getliterature.tsp?genericPartNumber=ADS124S08&fileType=pdf&src-supplier=Farnell; ComponentLink2URL: http://www.ti.com/lit/ds/symlink/ads124s06.pdf?src-supplier=Digi-Key; ComponentLink2Description: http://www.ti.com/lit/ds/symlink/ads124s06.pdf?src-supplier=Digi-Key; Supplier 1: Digi-Key; Supplier Part Number 1: 296-45170-1-ND
Y1 = SIT1602Bx: MEMS OSC XO 4.096MHZ H/LVCMOS; Max Supply Current: 4.5mA; MF: SiTime; MP: SiT1602BC-21-XXN-4.096000; RoHS Compliant: Yes; Width: 0.098inch; Height: 0.032inch; Mount: Surface Mount; Series: SIT1602; Case/Package: SMD/SMT

## Sheet TIA_SWITCHES.SchDoc
size A3; DrawnBy: Nicholas Sandor; Revision: V26C (V26.4a); SheetNumber: 5; SheetTotal: 7
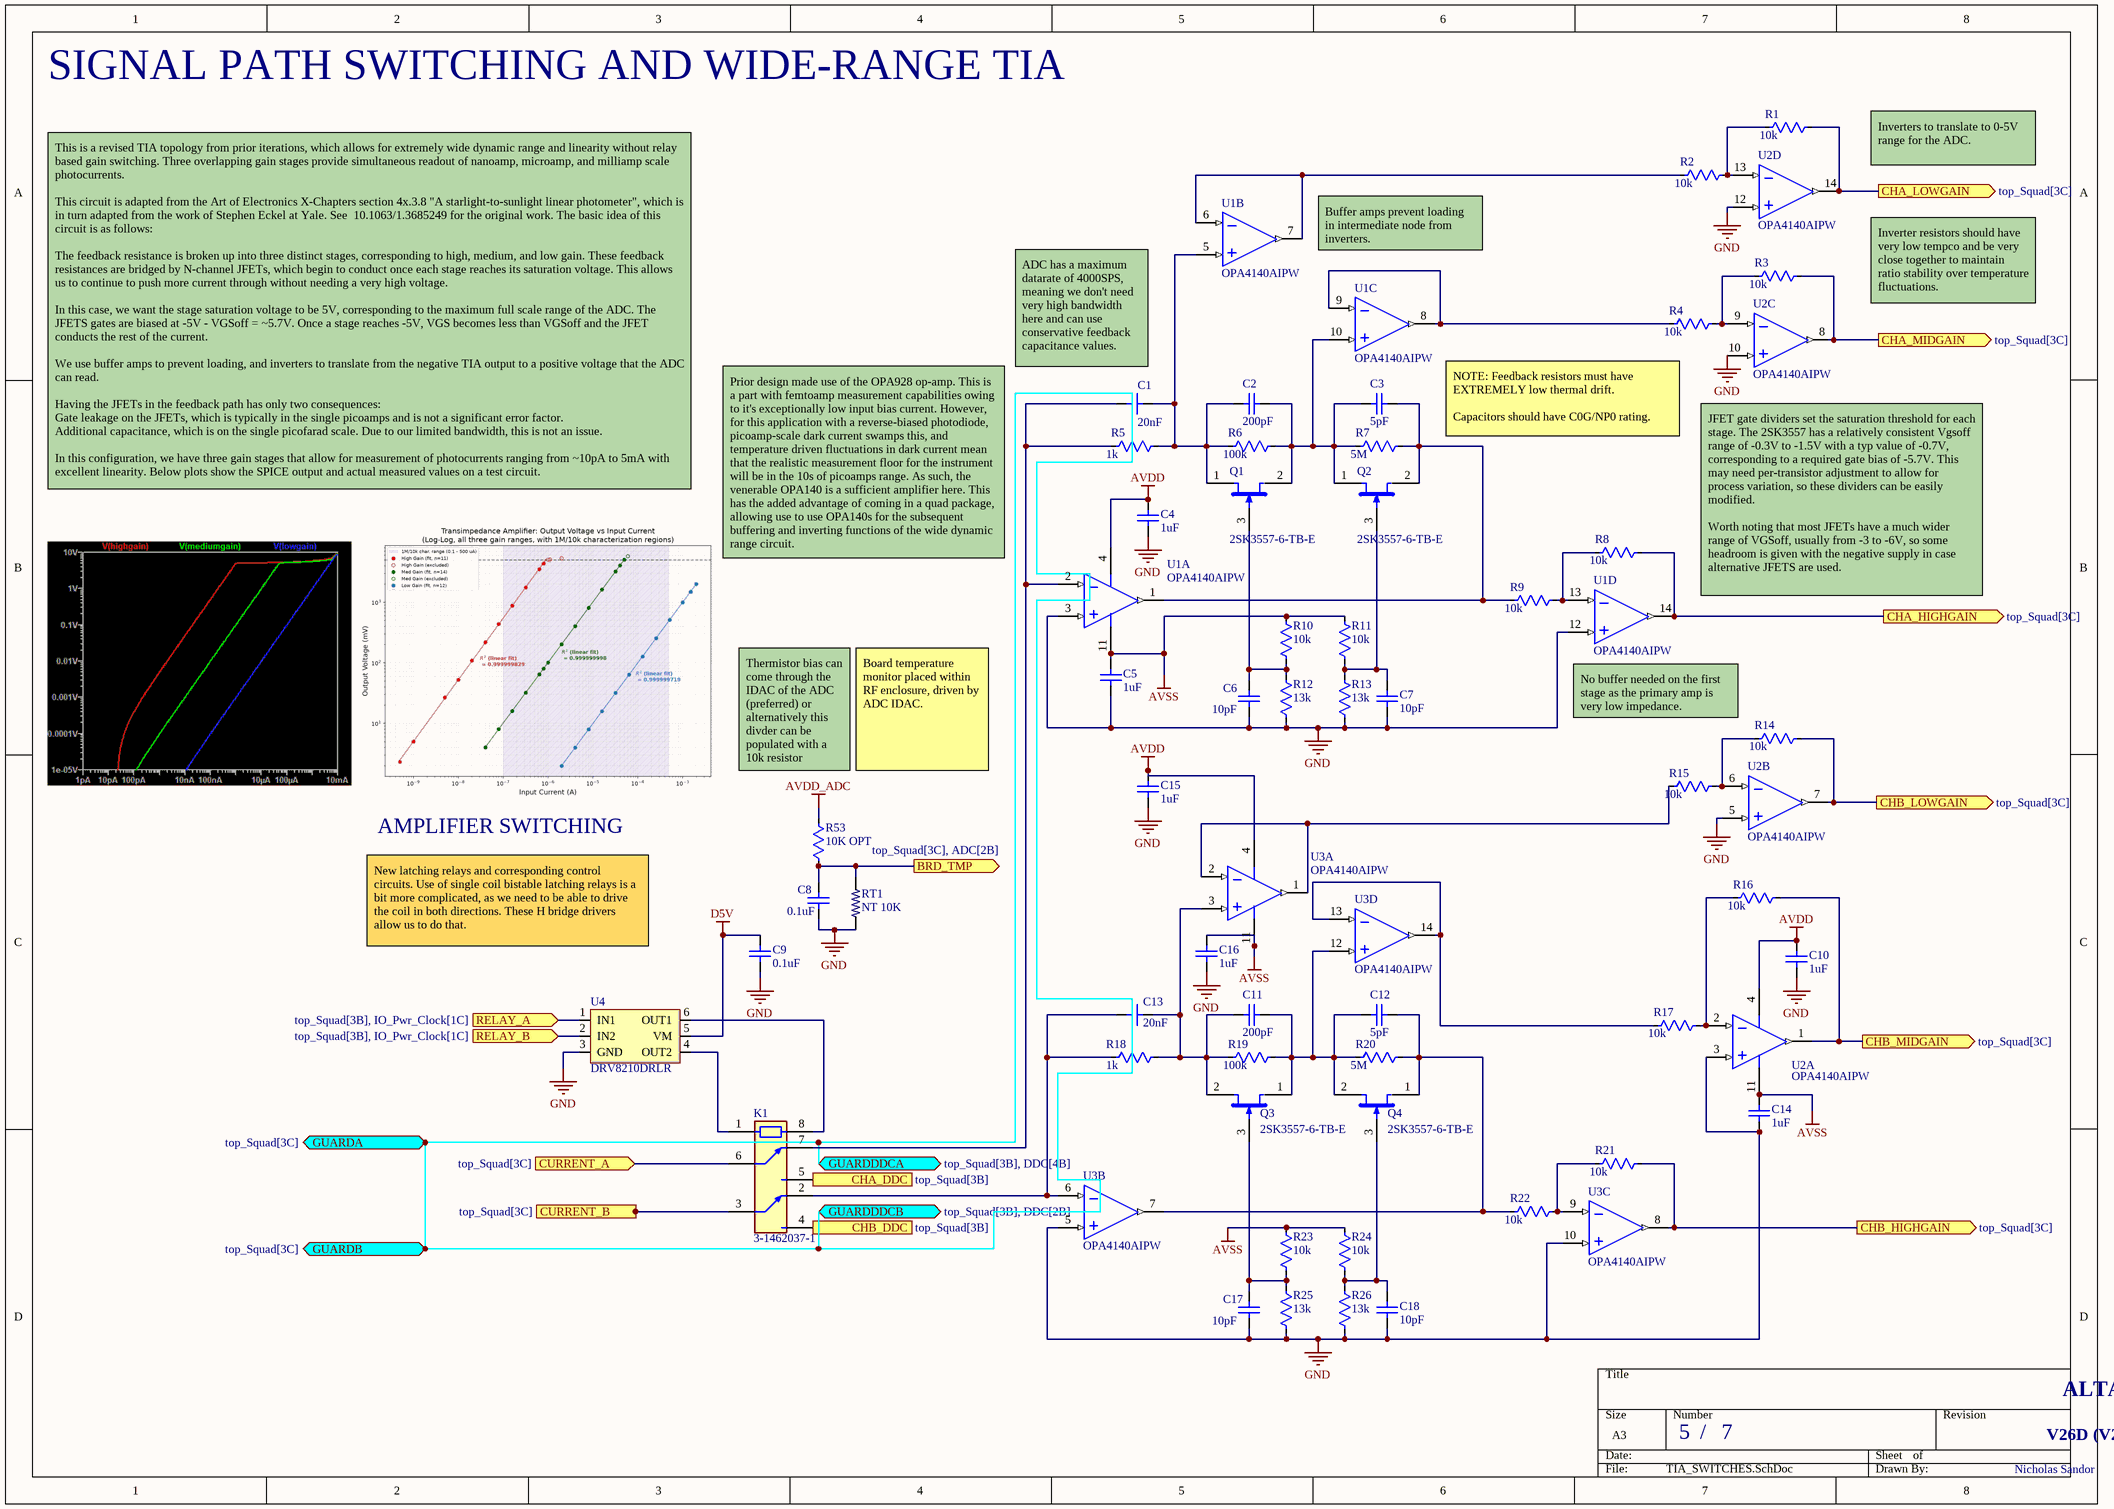
[diagram p4: TIA_SWITCHES.SchDoc]

### Parts
C1  20nF  [CAP 1206 UNKNOWN]
C2  200pF  [CAP 1206 UNKNOWN]
C3  5pF  [CAP 1206 UNKNOWN]
C4  1uF  [CAP 0603 IPC MID DENSITY]
C5  1uF  [CAP 0603 IPC MID DENSITY]
C6  10pF  [CAP 0603 IPC MID DENSITY MURATA]
C7  10pF  [CAP 0603 IPC MID DENSITY MURATA]
C8  0.1uF  [CAP 0603 IPC MID DENSITY]
C9  0.1uF  [CAP 0603 IPC MID DENSITY]
C10  1uF  [CAP 0603 IPC MID DENSITY]
C11  200pF  [CAP 1206 UNKNOWN]
C12  5pF  [CAP 1206 UNKNOWN]
C13  20nF  [CAP 1206 UNKNOWN]
C14  1uF  [CAP 0603 IPC MID DENSITY]
C15  1uF  [CAP 0603 IPC MID DENSITY]
C16  1uF  [CAP 0603 IPC MID DENSITY]
C17  10pF  [CAP 0603 IPC MID DENSITY MURATA]
C18  10pF  [CAP 0603 IPC MID DENSITY MURATA]
K1  3-1462037-1  [RELAY_3-1462037-1]
Q1  2SK3557-6-TB-E  [ONSC-CP-3-318AN_A_V]
Q2  2SK3557-6-TB-E  [ONSC-CP-3-318AN_A_V]
Q3  2SK3557-6-TB-E  [ONSC-CP-3-318AN_A_V]
Q4  2SK3557-6-TB-E  [ONSC-CP-3-318AN_A_V]
R1  10k  [RES 0603 IPC MID DENSITY]
R2  10k  [RES 0603 IPC MID DENSITY]
R3  10k  [RES 0603 IPC MID DENSITY]
R4  10k  [RES 0603 IPC MID DENSITY]
R5  1k  [RES 1206 IPC MID DENSITY]
R6  100k  [RES 1206 IPC MID DENSITY]
R7  5M  [RES 1206 IPC MID DENSITY]
R8  10k  [RES 0603 IPC MID DENSITY]
R9  10k  [RES 0603 IPC MID DENSITY]
R10  10k  [RES 0603 IPC MID DENSITY]
R11  10k  [RES 0603 IPC MID DENSITY]
R12  13k  [RES 0603 IPC MID DENSITY]
R13  13k  [RES 0603 IPC MID DENSITY]
R14  10k  [RES 0603 IPC MID DENSITY]
R15  10k  [RES 0603 IPC MID DENSITY]
R16  10k  [RES 0603 IPC MID DENSITY]
R17  10k  [RES 0603 IPC MID DENSITY]
R18  1k  [RES 1206 IPC MID DENSITY]
R19  100k  [RES 1206 IPC MID DENSITY]
R20  5M  [RES 1206 IPC MID DENSITY]
R21  10k  [RES 0603 IPC MID DENSITY]
R22  10k  [RES 0603 IPC MID DENSITY]
R23  10k  [RES 0603 IPC MID DENSITY]
R24  10k  [RES 0603 IPC MID DENSITY]
R25  13k  [RES 0603 IPC MID DENSITY]
R26  13k  [RES 0603 IPC MID DENSITY]
R53  10K OPT  [RES 0603 IPC MID DENSITY]
RT1  value NT 10K  [RES 0603 IPC MID DENSITY]  (hidden comment: NTC 0603 10K 1%)
U1  OPA4140AIPW  [PW0014A_N]  (parts A,B,C,D of 4)
U2  OPA4140AIPW  [PW0014A_N]  (parts A,B,C,D of 4)
U3  OPA4140AIPW  [PW0014A_N]  (parts A,B,C,D of 4)
U4  DRV8210DRLR  [SOT563]

### Ports
BRD_TMP (out, see top_Squad[3C], ADC[2B]), CHA_DDC (out, see top_Squad[3B]), CHA_HIGHGAIN (out, see top_Squad[3C]), CHA_LOWGAIN (out, see top_Squad[3C]), CHA_MIDGAIN (out, see top_Squad[3C]), CHB_DDC (out, see top_Squad[3B]), CHB_HIGHGAIN (out, see top_Squad[3C]), CHB_LOWGAIN (out, see top_Squad[3C]), CHB_MIDGAIN (out, see top_Squad[3C]), CURRENT_A (in, see top_Squad[3C]), CURRENT_B (in, see top_Squad[3C]), GUARDA (bidir, see top_Squad[3C]), GUARDB (bidir, see top_Squad[3C]), GUARDDDCA (bidir, see top_Squad[3B], DDC[4B]), GUARDDDCB (bidir, see top_Squad[3B], DDC[2B]), RELAY_A (in, see top_Squad[3B], IO_Pwr_Clock[1C]), RELAY_B (in, see top_Squad[3B], IO_Pwr_Clock[1C])

### Nets
AVDD: C4.2 C10.2 C15.2 U1.4(V+) U2.4(V+) U3.4(V+)
AVDD_ADC: R53.1
AVSS: C5.2 C14.2 C16.2 R10.2 R11.2 R23.2 R24.2 U1.11(V-) U2.11(V-) U3.11(V-)
D5V: C9.2 U4.5(VM)
GND: C4.1 C5.1 C6.1 C7.1 C8.1 C9.1 C10.1 C14.1 C15.1 C16.1 C17.1 C18.1 R12.1 R13.1 R25.1 R26.1 RT1.1 U1.3(IN_A+) U1.12(IN_D+) U2.3(IN_A+) U2.5(IN_B+) U2.10(IN_C+) U2.12(IN_D+) U3.5(IN_B+) U3.10(IN_C+) U4.3(GND)  [project net SYS_GND]
BRD_TMP_ADCIN: C8.2 R53.2 RT1.2 ; port BRD_TMP
GUARD: port GUARDB, port GUARDA, port GUARDDDCB, port GUARDDDCA
PD_A: K1.6(COM1) ; port CURRENT_A
PD_A: K1.3(COM2) ; port CURRENT_B  [a separate net that carries the same name]
RELAY_A: U4.1(IN1) ; port RELAY_A
RELAY_B: U4.2(IN2) ; port RELAY_B
NetC1_1: C1.1 C2.2 Q1.1(S) R5.2 R6.1 U1.5(IN_B+)
NetC1_2: C1.2 K1.7(NC1) R5.1 U1.2(IN_A-)
NetC2_1: C2.1 C3.2 Q1.2(D) Q2.1(S) R6.2 R7.1 U1.10(IN_C+)
NetC3_1: C3.1 Q2.2(D) R7.2 R9.1 U1.1(OUT_A)
NetC6_2: C6.2 Q1.3(G) R10.1 R12.2
NetC7_2: C7.2 Q2.3(G) R11.1 R13.2
NetC11_1: C11.1 C12.2 Q3.1(S) Q4.2(D) R19.2 R20.1 U3.12(IN_D+)
NetC11_2: C11.2 C13.1 Q3.2(D) R18.2 R19.1 U3.3(IN_A+)
NetC12_1: C12.1 Q4.1(S) R20.2 R22.1 U3.7(OUT_B)
NetC13_2: C13.2 K1.2(NC2) R18.1 U3.6(IN_B-)
NetC17_2: C17.2 Q3.3(G) R23.1 R25.2
NetC18_2: C18.2 Q4.3(G) R24.1 R26.2
NetK1_1: K1.1(COIL1) U4.4(OUT2)
NetK1_4: K1.4(NO2) ; port CHB_DDC
NetK1_5: K1.5(NO1) ; port CHA_DDC
NetK1_8: K1.8(COIL2) U4.6(OUT1)
NetR1_1: R1.1 R2.2 U2.13(IN_D-)
NetR1_2: R1.2 U2.14(OUT_D) ; port CHA_LOWGAIN
NetR2_1: R2.1 U1.6(IN_B-) U1.7(OUT_B)
NetR3_1: R3.1 R4.2 U2.9(IN_C-)
NetR3_2: R3.2 U2.8(OUT_C) ; port CHA_MIDGAIN
NetR4_1: R4.1 U1.8(OUT_C) U1.9(IN_C-)
NetR8_1: R8.1 R9.2 U1.13(IN_D-)
NetR8_2: R8.2 U1.14(OUT_D) ; port CHA_HIGHGAIN
NetR14_1: R14.1 R15.2 U2.6(IN_B-)
NetR14_2: R14.2 U2.7(OUT_B) ; port CHB_LOWGAIN
NetR15_1: R15.1 U3.1(OUT_A) U3.2(IN_A-)
NetR16_1: R16.1 R17.2 U2.2(IN_A-)
NetR16_2: R16.2 U2.1(OUT_A) ; port CHB_MIDGAIN
NetR17_1: R17.1 U3.13(IN_D-) U3.14(OUT_D)
NetR21_1: R21.1 R22.2 U3.9(IN_C-)
NetR21_2: R21.2 U3.8(OUT_C) ; port CHB_HIGHGAIN

### Notes on the sheet
- SIGNAL PATH SWITCHING AND WIDE-RANGE TIA
- Inverters to translate to 0-5V range for the ADC.
- (near U1) Buffer amps prevent loading in intermediate node from inverters.
- Inverter resistors should have very low tempco and be very close together to maintain ratio stability over temperature fluctuations.
- (near C1) ADC has a maximum datarate of 4000SPS, meaning we don't need very high bandwidth here and can use conservative feedback capacitance values.
- NOTE: Feedback resistors must have EXTREMELY low thermal drift.
  Capacitors should have C0G/NP0 rating.
- This is a revised TIA topology from prior iterations, which allows for extremely wide dynamic range and linearity without relay based gain switching. Three overlapping gain stages provide simultaneous readout of nanoamp, microamp, and milliamp scale photocurrents.
  This circuit is adapted from the Art of Electronics X-Chapters section 4x.3.8 "A starlight-to-sunlight linear photometer", which is in turn adapted from the work of Stephen Eckel at Yale. See  10.1063/1.3685249 for the original work. The basic idea of this circuit is as follows:
  The feedback resistance is broken up into three distinct stages, corresponding to high, medium, and low gain. These feedback resistances are bridged by N-channel JFETs, which begin to conduct once each stage reaches its saturation voltage. This allows us to continue to push more current through without needing a very high voltage.
  In this case, we want the stage saturation voltage to be 5V, corresponding to the maximum full scale range of the ADC. The JFETS gates are biased at -5V - VGSoff = ~5.7V. Once a stage reaches -5V, VGS becomes less than VGSoff and the JFET conducts the rest of the current.
  We use buffer amps to prevent loading, and inverters to translate from the negative TIA output to a positive voltage that the ADC can read.
  Having the JFETs in the feedback path has only two consequences:
  Gate leakage on the JFETs, which is typically in the single picoamps and is not a significant error factor.
  Additional capacitance, which is on the single picofarad scale. Due to our limited bandwidth, this is not an issue.
  In this configuration, we have three gain stages that allow for measurement of photocurrents ranging from ~10pA to 5mA with excellent linearity. Below plots show the SPICE output and actual measured values on a test circuit.
- Prior design made use of the OPA928 op-amp. This is a part with femtoamp measurement capabilities owing to it's exceptionally low input bias current. However, for this application with a reverse-biased photodiode, picoamp-scale dark current swamps this, and temperature driven fluctuations in dark current mean that the realistic measurement floor for the instrument will be in the 10s of picoamps range. As such, the venerable OPA140 is a sufficient amplifier here. This has the added advantage of coming in a quad package, allowing use to use OPA140s for the subsequent buffering and inverting functions of the wide dynamic range circuit.
- JFET gate dividers set the saturation threshold for each stage. The 2SK3557 has a relatively consistent Vgsoff range of -0.3V to -1.5V with a typ value of -0.7V, corresponding to a required gate bias of -5.7V. This may need per-transistor adjustment to allow for process variation, so these dividers can be easily modified.
  Worth noting that most JFETs have a much wider range of VGSoff, usually from -3 to -6V, so some headroom is given with the negative supply in case alternative JFETS are used.
- No buffer needed on the first stage as the primary amp is very low impedance.
- (near R53) Thermistor bias can come through the IDAC of the ADC (preferred) or alternatively this divder can be populated with a 10k resistor
- Board temperature monitor placed within RF enclosure, driven by ADC IDAC.
- AMPLIFIER SWITCHING
- New latching relays and corresponding control circuits. Use of single coil bistable latching relays is a bit more complicated, as we need to be able to drive the coil in both directions. These H bridge drivers allow us to do that.
- /
- V26D (V26.5a)
- ALTAIR PhotoDiode ReadOut (PDRO) - Squad

### Library data of the parts
C1-C3 C6 C7 C11-C13 C17 C18 = CAP: Wurth Elektronik 885012008037 - Cap Ceramic 10pF 5% 50V NP0 1206; MF: Wurth Elektronik; MP: 885012008037
C4 C5 C10 C14-C16 = CAP: Murata GRT188R61H105KE13D - Cap MLCC AEC-Q200 X5R 1uF 50V 0603; MF: Murata; MP: GRT188R61H105KE13D
C8 C9 = CAP: as C19 on sheet ADC; MF: Kemet; MP: C0603C104K5RACAUTO
K1 = 3-1462037-1: RelÃ© RF, CC, biestable, 1 bobina, 2 conectores DPDT-CO de forma C, capacidad de contacto de 2 A, voltaje de bobina de 4,5 V CC, voltaje de contacto de 250 V CA, Axicom IM; MF: TE Connectivity; SnapEDA_Link: https://www.snapeda.com/parts/3-1462037-1/TE+Connectivity+Potter+%2526+Brumfield+Relays/view-part/?ref=snap; Package: None; Value: *; MP: 3-1462037-1; EU_RoHS_Compliance: Compliant; Check_prices: https://www.snapeda.com/parts/3-1462037-1/TE+Connectivity+Potter+%2526+Brumfield+Relays/view-part/?ref=eda
Q1-Q4 = CMP-1062-00010-1: N-Channel JFET, 15 V, 10 to 20 mA, 35 mS, 3-Pin CP, Pb-Free, Tape and Reel; Manufacturer: On Semiconductor; Channel Polarity: N Channel; IDSS Max (uA): 20000; IDSS Min (uA): 10000; PackageDescription: 3-Pin Small Outline Transistor, Body 2.9 x 1.5 mm, Pitch 0.95 mm; RoHS: Pb-Free; PackageReference: CP-3-318AN_A; ComponentLink2Description: Datasheet; Packing: Tape and Reel; ComponentLink2URL: http://www.onsemi.com/pub_link/Collateral/2SK3557-D.PDF; ComponentLink1URL: http://www.onsemi.com/; PartNumber: 2SK3557-6-TB-E; ComponentLink3URL: http://www.onsemi.com/pub_link/Collateral/EN6619-D.PDF; ComponentLink3Description: Package Specification; Mounting Technology: Surface Mount; ComponentLink1Description: Manufacturer URL
R1-R26 = RES: Vishay TNPV12061M00BYEN - Res 1MOhm 0.1% 1/4W SMD 1206; MF: Vishay Dale; MP: TNPV12061M00BYEN
R53 = RES: Yageo RC0402JR-070RL - Res 0 Ohms 1/16W SMD 0402; MF: YAGEO; MP: RC0402JR-070RL
RT1 = THERM_RES NTC 0603 10K 1%: THERMISTOR NTC 10KOHM 3380K 0603; MF: Murata; MP: NCU18XH103F60RB; RoHS: No; Category: Thermistors; Stock 1: 48580; Case/Package: 0603; Case Code (Metric): 1608; Case Code (Imperial): 0603; Min Operating Temperature: -40°C; Max Operating Temperature: 125°C; REACH SVHC: No SVHC; ComponentLink1URL: http://www.farnell.com/datasheets/2095755.pdf?src-supplier=Farnell; ComponentLink1Description: http://www.farnell.com/datasheets/2095755.pdf?src-supplier=Farnell; ComponentLink2URL: https://www.murata.com/en-us/products/productdata/8796836233246/L0770E.pdf?src-supplier=Digi-Key; ComponentLink2Description: https://www.murata.com/en-us/products/productdata/8796836233246/L0770E.pdf?src-supplier=Digi-Key; ComponentLink3URL: http://www.farnell.com/datasheets/2095755.pdf?src-supplier=Element14; ComponentLink3Description: http://www.farnell.com/datasheets/2095755.pdf?src-supplier=Element14; Supplier 1: Digi-Key; Supplier Part Number 1: 490-16279-1-ND
U1-U3 = CMP-0272-01663-3: 11 MHz, Single Supply, Low Noise, Precision, Rail-to-Rail Output, JFET Amplifier, 4.5 to 36 V, -40 to 125 degC, 14-pin SOP (PW14), Green (RoHS & no Sb/Br); Manufacturer: Texas Instruments; Number of Channels: 4; Sub Family: High Supply Voltage Amplifier (>=30V), Low Input Bias Current Amp (<=10pA), Low Noise Amp (<=10nV/rtHz), Low Offset Voltage Amplifier (<=500uV), Precision Amplifier; CMRR(Min)(dB): 126; Packing: BULK; Offset Drift(Typ)(uV/C): 0.35; Iq per channel(Max)(mA): 2; Rating: Catalog; Total Supply Voltage(Min)(+5V is 5, +/-5V is 10): 4.5; Total Supply Voltage(Max)(+5V is 5, +/-5V is 10): 36; IIB(Max)(pA): 10; Vio (25C)(Max)(mV): 0.12; GBW(Typ)(MHz): 11; Slew Rate(Typ)(V/us): 20; Code_JEDEC: MO-153; ComponentLink3URL: http://www.ti.com/litv/pdf/mpds360; ComponentLink1URL: http://www.ti.com/; Mounting Technology: Surface Mount; Eco-Plan: Green (RoHS & no Sb/Br); PackageReference: PW0014A; ComponentLink1Description: Manufacturer URL; ComponentLink2Description: Datasheet; PackageVersion: 4040064-3/G, 02/2011; PackageDescription: 14-Pin Plastic Small Outline, Body 5 x 4.4 mm, Pitch 0.65 mm; ComponentLink3Description: Package Specification; DatasheetVersion: SBOS498A; ComponentLink2URL: http://www.ti.com/lit/ds/symlink/opa4140.pdf; PartNumber: OPA4140AIPW
U4 = DRV8210DRLR: Bipolar Motor Driver NMOS PWM SOT-563

## Sheet BIAS_IO.SchDoc
size A4; SheetNumber: 4; SheetTotal: 7
Used 2 times, as channels A, B. Parts and nets are listed once, with the designators drawn on the sheet.
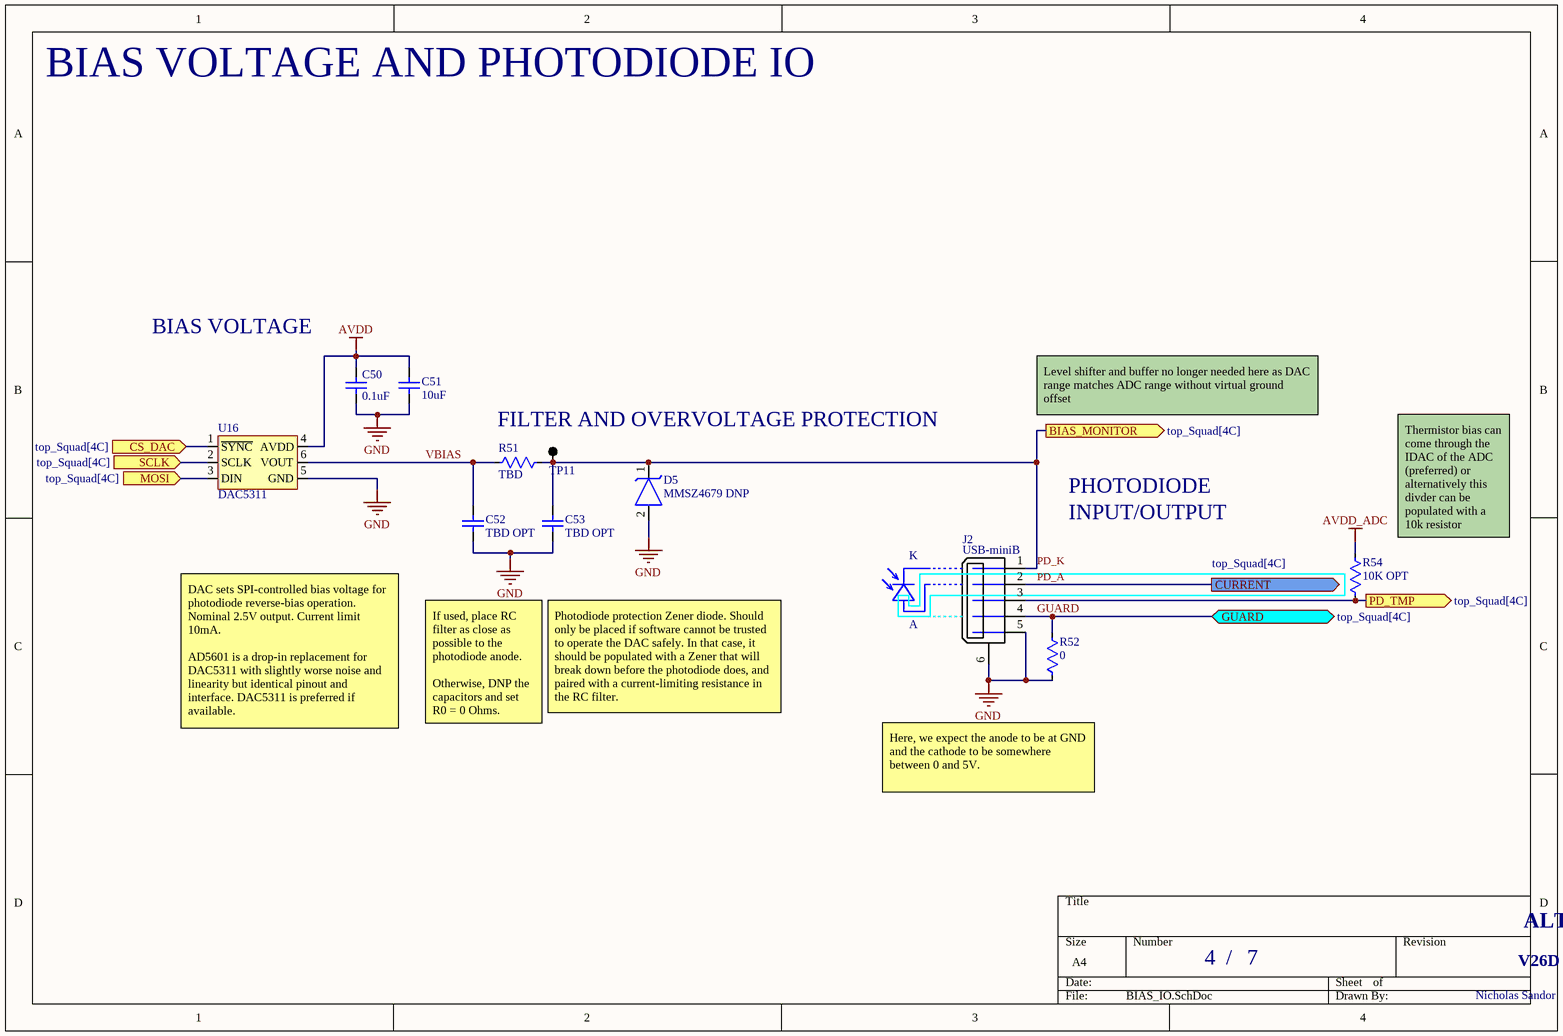
[diagram p5: BIAS_IO.SchDoc]

### Parts
C50  0.1uF  [CAP 0603 IPC MID DENSITY]
C51  10uF  [CAP 0805 IPC MID DENSITY]
C52  TBD OPT  [CAP 0603 IPC MID DENSITY]
C53  TBD OPT  [CAP 0603 IPC MID DENSITY]
D5  MMSZ4679 DNP  [SOD-123 ONSEMI SMALL PADS]
J2  USB-miniB  [USB_MINIB_RIGHTANGLE]
R51  TBD  [RES 0603 IPC MID DENSITY]
R52  0  [RES 0402 IPC MID DENSITY]
R54  10K OPT  [RES 0603 IPC MID DENSITY]
TP11  Testpoint  [TESTPOINT THT]  (value not drawn)  (no BOM)
U16  DAC5311  [SOT363-6 MID DENSITY]

### Ports
BIAS_MONITOR (out, see top_Squad[4C]), CS_DAC (in, see top_Squad[4C]), CURRENT (out, see top_Squad[4C]), GUARD (bidir, see top_Squad[4C]), MOSI (in, see top_Squad[4C]), PD_TMP (out, see top_Squad[4C]), SCLK (in, see top_Squad[4C])

### Nets
AVDD: C50.2 C51.2 U16.4(AVDD)
AVDD_ADC: R54.1
GND: C50.1 C51.1 C52.1 C53.1 D5.2(Anode) J2.5 J2.6(SHLD) R52.2 U16.5(GND)
CS_DAC: U16.1(~{SYNC}) ; port CS_DAC
GUARD: J2.4 R52.1 ; port GUARD
MOSI: U16.3(DIN) ; port MOSI
PD_A: J2.2 ; port CURRENT
PD_K: C53.2 D5.1(Cathode) J2.1 R51.1 TP11.1 ; port BIAS_MONITOR
PD_TMP: J2.3 R54.2 ; port PD_TMP
SCLK: U16.2(SCLK) ; port SCLK
VBIAS: C52.2 R51.2 U16.6(VOUT)

### Channels
A: designators end in A; ports BIAS_MONITOR=PD_K CS_DAC=SPI_CS_DAC_CHA CURRENT=PD_A GUARD=GUARD MOSI=rSPI_MOSI PD_TMP=PDA_TMP_ADCIN SCLK=rSPI_SCLK
B: designators end in B; ports BIAS_MONITOR=PD_K CS_DAC=SPI_CS_DAC_CHB CURRENT=PD_A GUARD=GUARD MOSI=rSPI_MOSI PD_TMP=PDB_TMP_ADCIN SCLK=rSPI_SCLK

### Notes on the sheet
- BIAS VOLTAGE AND PHOTODIODE IO
- BIAS VOLTAGE
- FILTER AND OVERVOLTAGE PROTECTION
- Level shifter and buffer no longer needed here as DAC range matches ADC range without virtual ground offset
- PHOTODIODE
- K
- INPUT/OUTPUT
- (near R54) Thermistor bias can come through the IDAC of the ADC (preferred) or alternatively this divder can be populated with a 10k resistor
- A
- If used, place RC filter as close as possible to the photodiode anode.
  Otherwise, DNP the capacitors and set R0 = 0 Ohms.
- Photodiode protection Zener diode. Should only be placed if software cannot be trusted to operate the DAC safely. In that case, it should be populated with a Zener that will break down before the photodiode does, and paired with a current-limiting resistance in the RC filter.
- DAC sets SPI-controlled bias voltage for photodiode reverse-bias operation. Nominal 2.5V output. Current limit 10mA.
  AD5601 is a drop-in replacement for DAC5311 with slightly worse noise and linearity but identical pinout and interface. DAC5311 is preferred if available.
- (near R52) Here, we expect the anode to be at GND and the cathode to be somewhere between 0 and 5V.
- /
- ALTAIR PhotoDiode ReadOut (PDRO) - Squad

### Library data of the parts
C50 = CAP: as C19 on sheet ADC; MF: Kemet; MP: C0603C104K5RACAUTO
C51 = CAP: as C39 on sheet Power; MF: Murata; MP: GRM21BR61E106KA73L
C52 C53 = CAP: Murata GRT188R61H105KE13D - Cap Ceramic 1uF 10% 50V X5R 0603 (Placeholder); MF: Murata; MP: GRT188R61H105KE13D
D5 = Zener: DIODE ZENER SOD123; MF: onsemi; MP: MMSZ4679T1G
J2 = USB-miniB: Conn Mini-USB RCP 5 POS Solder ST Thru-Hole 5 Terminal 1 Port; Number of Positions: 5; Gender: Female; MF: Amphenol Commercial; MP: UE25BE5510H; RoHS: Yes; Category: USB Connectors; Stock 1: 6446; Mount: Through Hole; Color: Black; Contact Material: Copper Alloy; Contact Plating: Gold; Number of Contacts: 5; Termination: PCB; Features: High Temperature; Lead Free: Lead Free; Flammability Rating: UL94 V-0; ComponentLink1URL: http://components.arrow.com/part/dataview/0323_00956300?src-supplier=Arrow+Europe; ComponentLink1Description: http://components.arrow.com/part/dataview/0323_00956300?src-supplier=Arrow+Europe; ComponentLink2URL: http://www.alliedelec.com/m/d/e7e3d7a920045eebbdef787e60d8b001.pdf?src-supplier=Allied+Electronics; ComponentLink2Description: http://www.alliedelec.com/m/d/e7e3d7a920045eebbdef787e60d8b001.pdf?src-supplier=Allied+Electronics; ComponentLink3URL: https://www.amphenolcanada.com/ProductSearch/drawings/AC/UE25BEX510X.pdf?src-supplier=Digi-Key; ComponentLink3Description: https://www.amphenolcanada.com/ProductSearch/drawings/AC/UE25BEX510X.pdf?src-supplier=Digi-Key; Supplier 1: Digi-Key; Supplier Part Number 1: UE25BE5510H-ND
R51 R52 R54 = RES: as R53 on sheet TIA_SWITCHES; MF: YAGEO; MP: RC0402JR-070RL
U16 = DAC5311: DAC 8bit 1 channel SPI Supply Reference Buffered Voltage; MF: Texas Instruments; MP: DAC5311IDCKR